# EAGLE schematic HMC5883L_Breakout-v11 (EAGLE 6.2)
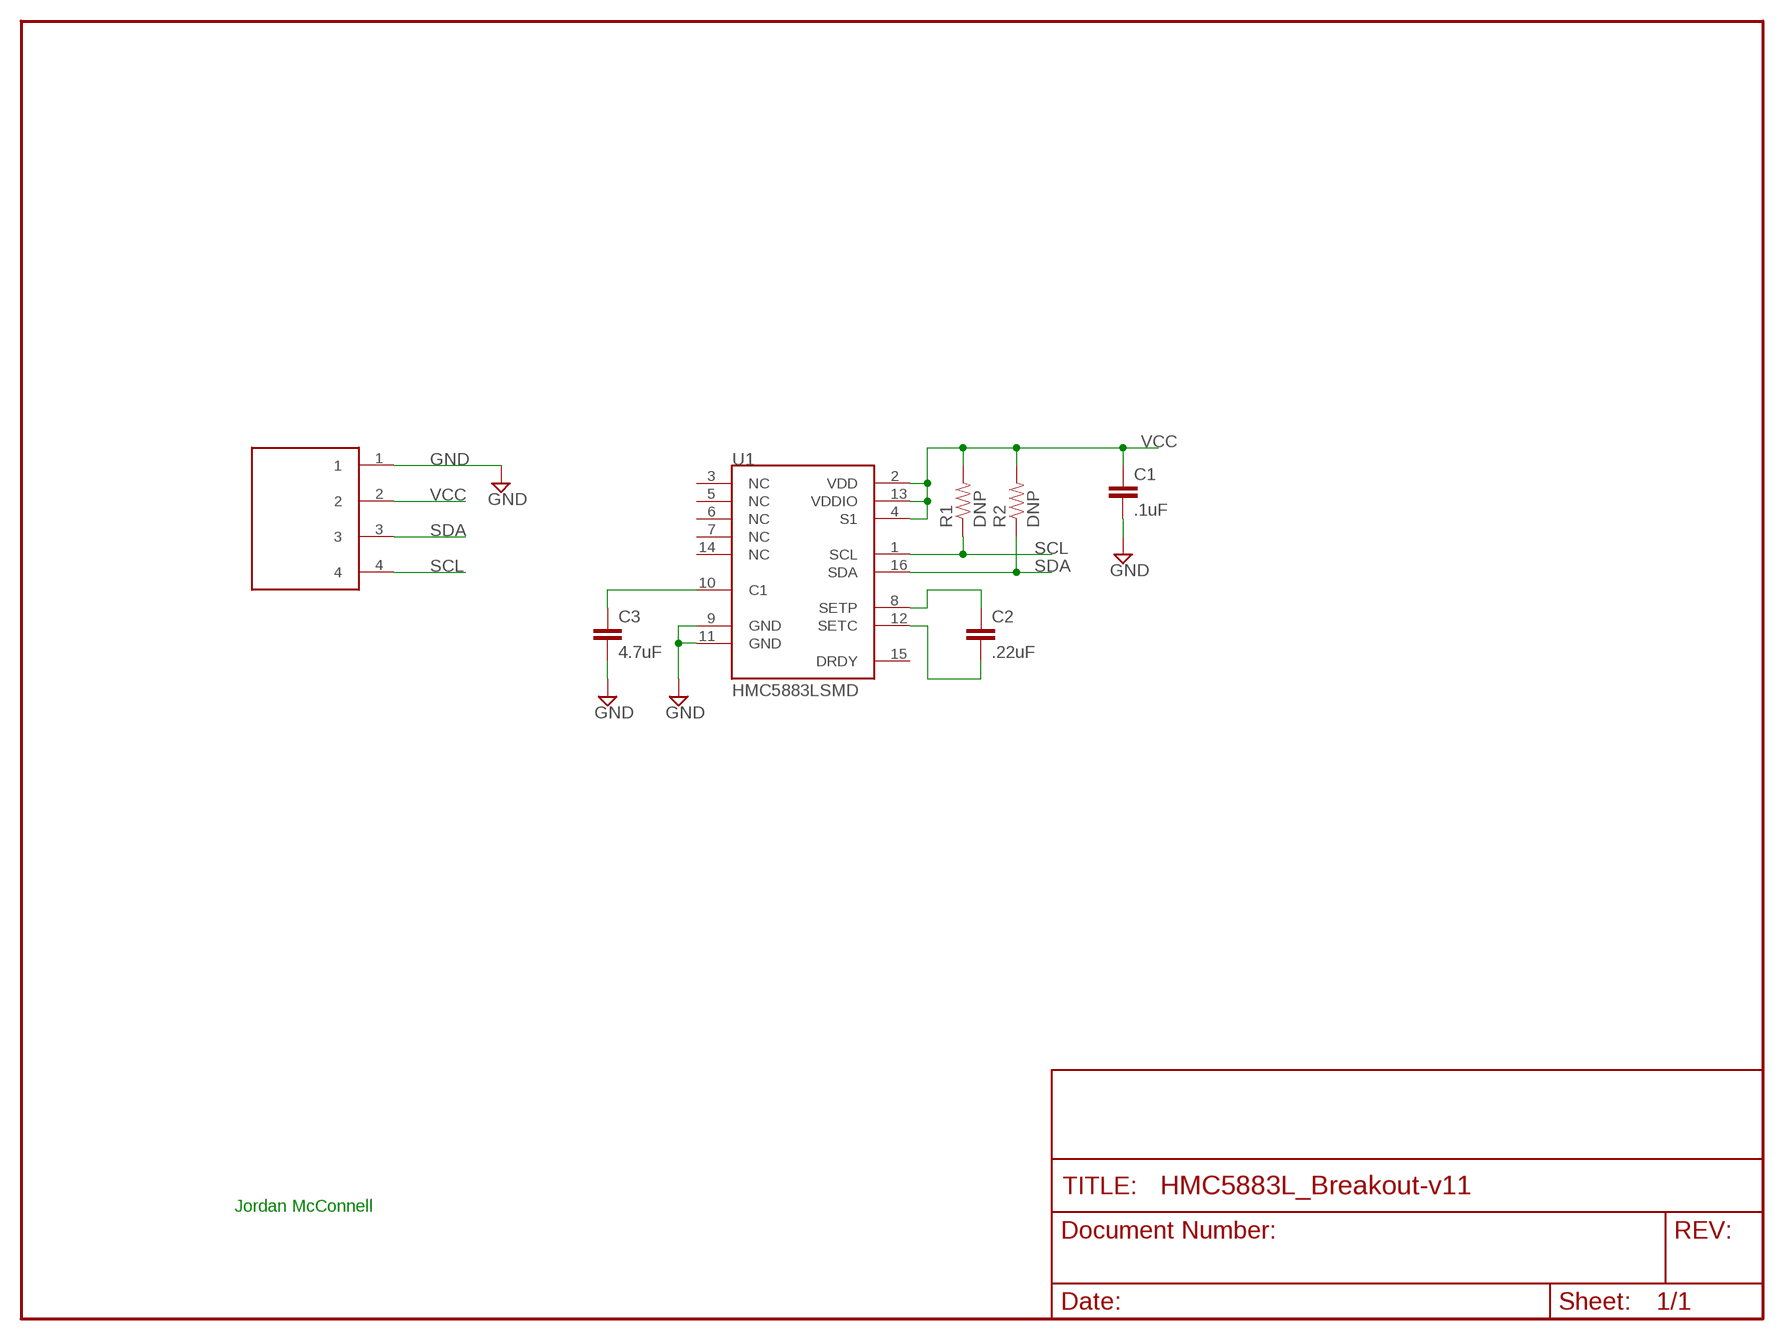
[diagram p0: schematic, sheet 1]

## Parts
C1  .1uF  CAP0402-CAP  [0402-CAP]
C2  .22uF  CAP0402-CAP  [0402-CAP]
C3  4.7uF  CAP0402-CAP  [0402-CAP]
JP1  M80-879  [M80-879]
R1  DNP  RESISTOR0402-RES  [0402-RES]
R2  DNP  RESISTOR0402-RES  [0402-RES]
U1  HMC5883LSMD  [16LPCC]

## Nets
GND: C1.2 C3.2 JP1.1 U1.9(GND) U1.11(GND)
N$1: C3.1 U1.10(C1)
N$4: C2.1 U1.8(SETP)
N$5: C2.2 U1.12(SETC)
SCL: JP1.4 R1.1 U1.1(SCL)
SDA: JP1.3 R2.1 U1.16(SDA)
VCC: C1.1 JP1.2 R1.2 R2.2 U1.2(VDD) U1.4(S1) U1.13(VDDIO)
Unconnected: U1.3(NC) U1.5(NC) U1.6(NC) U1.7(NC) U1.14(NC) U1.15(DRDY)

## Notes on the sheet
- Jordan McConnell

## Library data of the parts
C1-C3 = SparkFun:CAP: Capacitor Standard 0603 ceramic capacitor, and 0.1" leaded capacitor.
JP1 = harwin:M80-879
R1 R2 = SparkFun:RESISTOR: Resistor Basic schematic elements and footprints for 0603, 1206, and PTH resistors.
U1 = SparkFun:HMC5883L: 3 Axis Digital Compass IC